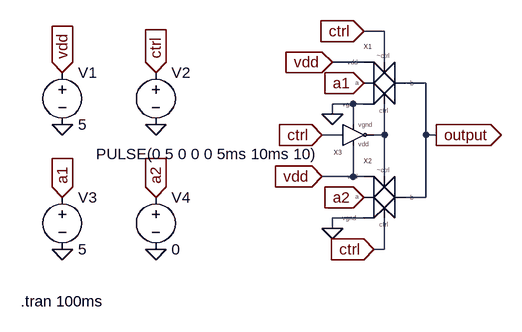
[diagram p0: schematic Mux Using Transmission Gate.asc]
Mux Using Transmission Gate.asc, the LTspice schematic file:
Version 4.1
SHEET 1 880 680
WIRE 176 16 144 16
WIRE 144 64 96 64
WIRE 176 64 176 16
WIRE 240 96 208 96
WIRE 128 128 96 128
WIRE 144 128 128 128
WIRE 96 144 96 128
WIRE 128 160 128 128
WIRE 112 176 80 176
WIRE 176 176 176 128
WIRE 176 176 160 176
WIRE 240 176 240 96
WIRE 256 176 240 176
WIRE 128 240 128 192
WIRE 128 240 80 240
WIRE 144 240 128 240
WIRE 176 240 176 176
WIRE 240 272 240 176
WIRE 240 272 208 272
WIRE 144 304 96 304
WIRE 96 320 96 304
WIRE 176 352 176 304
WIRE 176 352 160 352
FLAG 80 176 ctrl
IOPIN 80 176 In
FLAG 96 64 vdd
IOPIN 96 64 In
FLAG 80 240 vdd
IOPIN 80 240 In
FLAG 96 144 0
FLAG 96 320 0
FLAG 160 352 ctrl
IOPIN 160 352 In
FLAG 144 16 ctrl
IOPIN 144 16 In
FLAG 144 96 a1
IOPIN 144 96 In
FLAG 144 272 a2
IOPIN 144 272 In
FLAG 256 176 output
IOPIN 256 176 Out
FLAG -320 160 0
FLAG -176 160 0
FLAG -320 352 0
FLAG -176 352 0
FLAG -320 80 vdd
IOPIN -320 80 In
FLAG -176 272 a2
IOPIN -176 272 In
FLAG -320 272 a1
IOPIN -320 272 In
FLAG -176 80 ctrl
IOPIN -176 80 In
SYMBOL Transmission_Gate_2 176 80 R0
SYMATTR InstName X1
SYMBOL Transmission_Gate_2 176 256 R0
SYMATTR InstName X2
SYMBOL CMOS_Inverter 128 176 M180
SYMATTR InstName X3
SYMBOL voltage -320 64 R0
WINDOW 123 0 0 Left 0
WINDOW 39 0 0 Left 0
SYMATTR InstName V1
SYMATTR Value 5
SYMBOL voltage -176 64 R0
WINDOW 3 -92 141 Left 2
WINDOW 123 0 0 Left 0
WINDOW 39 0 0 Left 0
SYMATTR InstName V2
SYMATTR Value PULSE(0 5 0 0 0 5ms 10ms 10)
SYMBOL voltage -320 256 R0
WINDOW 123 0 0 Left 0
WINDOW 39 0 0 Left 0
SYMATTR InstName V3
SYMATTR Value 5
SYMBOL voltage -176 256 R0
WINDOW 123 0 0 Left 0
WINDOW 39 0 0 Left 0
SYMATTR InstName V4
SYMATTR Value 0
TEXT -384 432 Left 2 !.tran 100ms

The netlist it stands for:
* Mux Using Transmission Gate.asc
X§X1 vdd 0 a1 output N001 ctrl Transmission_Gate_2  ; pins vdd vgnd a b ctrl ~ctrl
X§X2 vdd 0 a2 output ctrl N001 Transmission_Gate_2  ; pins vdd vgnd a b ctrl ~ctrl
X§X3 ctrl N001 vdd 0 CMOS_Inverter  ; pins i o vdd vgnd
V1 vdd 0 5
V2 ctrl 0 PULSE(0 5 0 0 0 5ms 10ms 10)
V3 a1 0 5
V4 a2 0 0
.tran 100ms
.backanno
.end